# Altium schematic sheet 08_Peripherals.SchDoc
size A4
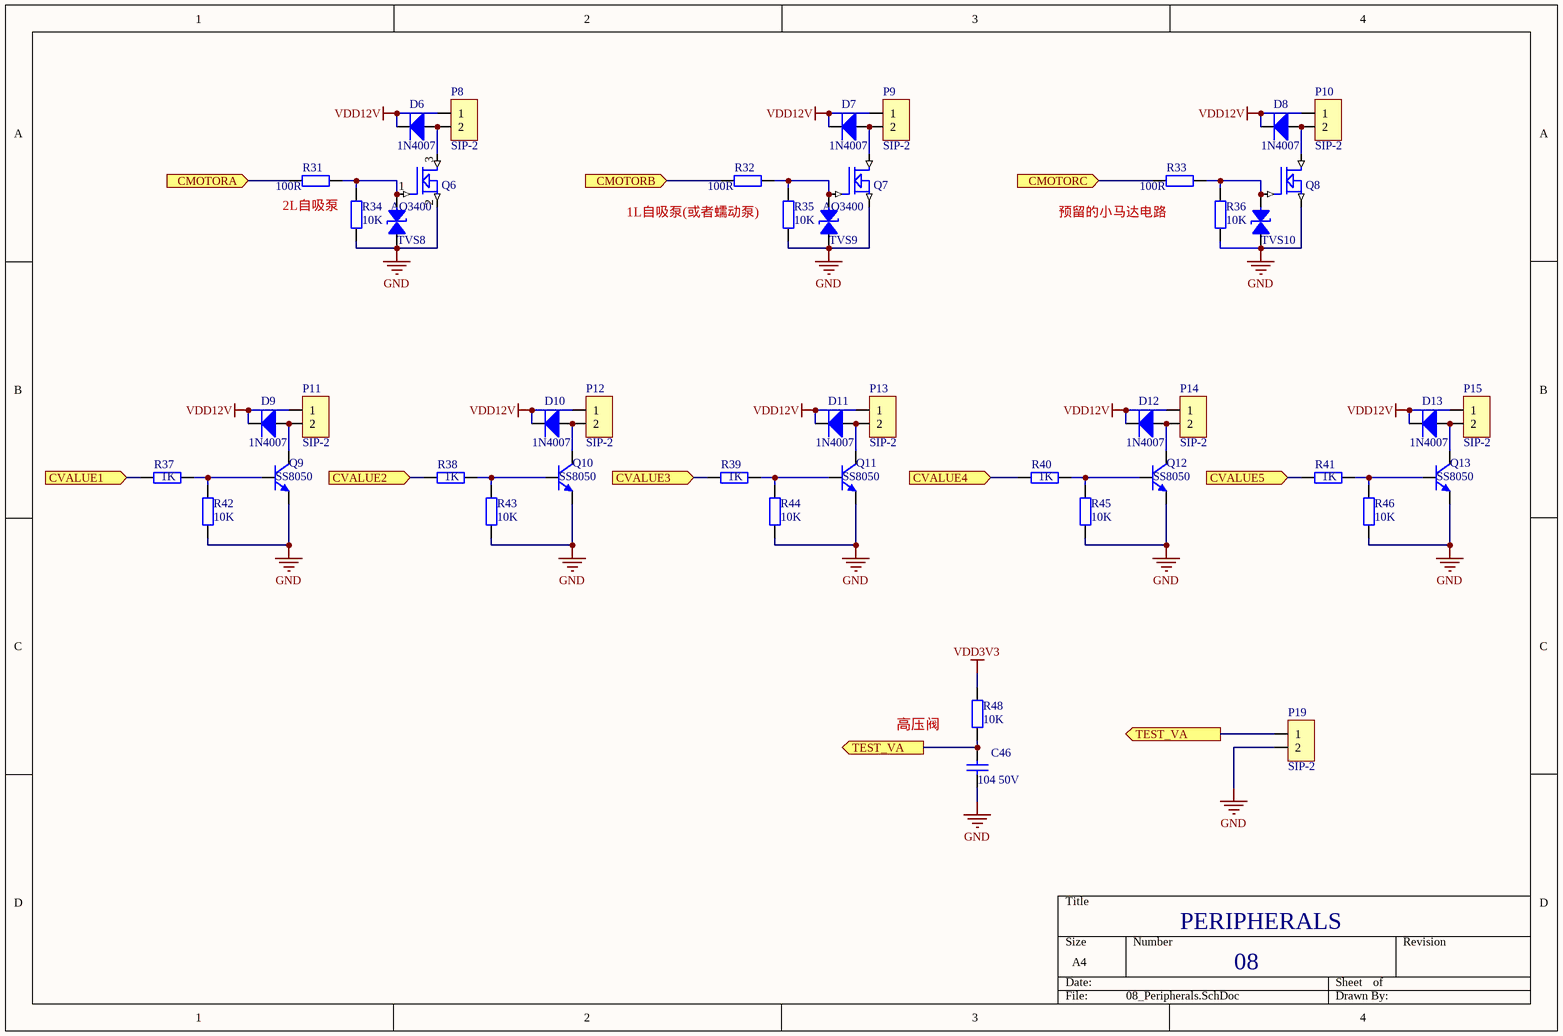
[diagram p0: 08_Peripherals.SchDoc]

## Parts
C46  104 50V  [SMD-0603C]
D6  1N4007  [DO-214-AC]
D7  1N4007  [DO-214-AC]
D8  1N4007  [DO-214-AC]
D9  1N4007  [DO-214-AC]
D10  1N4007  [DO-214-AC]
D11  1N4007  [DO-214-AC]
D12  1N4007  [DO-214-AC]
D13  1N4007  [DO-214-AC]
P8  SIP-2  [XH-2.54-2P-LI]
P9  SIP-2  [XH-2.54-2P-LI]
P10  SIP-2  [XH-2.54-2P-LI]
P11  SIP-2  [XH-2.54-2P-LI]
P12  SIP-2  [XH-2.54-2P-LI]
P13  SIP-2  [XH-2.54-2P-LI]
P14  SIP-2  [XH-2.54-2P-LI]
P15  SIP-2  [XH-2.54-2P-LI]
P19  SIP-2  [XH-2.54-2P-LI]
Q6  AO3400  [SOT-23]
Q7  AO3400  [SOT-23]
Q8  AO3400  [SOT-23]  (value not drawn)
Q9  SS8050  [SOT-23]
Q10  SS8050  [SOT-23]
Q11  SS8050  [SOT-23]
Q12  SS8050  [SOT-23]
Q13  SS8050  [SOT-23]
R31  100R  [SMD-0603]
R32  100R  [SMD-0603]
R33  100R  [SMD-0603]
R34  10K  [SMD-0603]
R35  10K  [SMD-0603]
R36  10K  [SMD-0603]
R37  1K  [SMD-0603]
R38  1K  [SMD-0603]
R39  1K  [SMD-0603]
R40  1K  [SMD-0603]
R41  1K  [SMD-0603]
R42  10K  [SMD-0603]
R43  10K  [SMD-0603]
R44  10K  [SMD-0603]
R45  10K  [SMD-0603]
R46  10K  [SMD-0603]
R48  10K  [SMD-0603]
TVS8  ESD5Z5.0CT1G  [SOD-523]  (value not drawn)
TVS9  ESD5Z5.0CT1G  [SOD-523]  (value not drawn)
TVS10  ESD5Z5.0CT1G  [SOD-523]  (value not drawn)

## Ports
CMOTORA (in), CMOTORB (in), CMOTORC (in), CVALUE1 (in), CVALUE2 (in), CVALUE3 (in), CVALUE4 (in), CVALUE5 (in), TEST_VA (out)

## Nets
GND: C46.1 P19.2 Q6.2(S) Q7.2(S) Q8.2(S) Q9.2(E) Q10.2(E) Q11.2(E) Q12.2(E) Q13.2(E) R34.2 R35.2 R36.2 R42.2 R43.2 R44.2 R45.2 R46.2 TVS8.1(A) TVS9.1(A) TVS10.1(A)
VDD3V3: R48.2
VDD12V: D6.2(K) D7.2(K) D8.2(K) D9.2(K) D10.2(K) D11.2(K) D12.2(K) D13.2(K) P8.1 P9.1 P10.1 P11.1 P12.1 P13.1 P14.1 P15.1
CMOTORA: R31.2 ; port CMOTORA
CMOTORB: R32.2 ; port CMOTORB
CMOTORC: R33.2 ; port CMOTORC
CVALUE1: R37.2 ; port CVALUE1
CVALUE2: R38.2 ; port CVALUE2
CVALUE3: R39.2 ; port CVALUE3
CVALUE4: R40.2 ; port CVALUE4
CVALUE5: R41.2 ; port CVALUE5
TEST_VA: C46.2 P19.1 R48.1 ; port TEST_VA
NetD6_1: D6.1(A) P8.2 Q6.3(D)
NetD7_1: D7.1(A) P9.2 Q7.3(D)
NetD8_1: D8.1(A) P10.2 Q8.3(D)
NetD9_1: D9.1(A) P11.2 Q9.3(C)
NetD10_1: D10.1(A) P12.2 Q10.3(C)
NetD11_1: D11.1(A) P13.2 Q11.3(C)
NetD12_1: D12.1(A) P14.2 Q12.3(C)
NetD13_1: D13.1(A) P15.2 Q13.3(C)
NetQ6_1: Q6.1(G) R31.1 R34.1 TVS8.2(B)
NetQ7_1: Q7.1(G) R32.1 R35.1 TVS9.2(B)
NetQ8_1: Q8.1(G) R33.1 R36.1 TVS10.2(B)
NetQ9_1: Q9.1(B) R37.1 R42.1
NetQ10_1: Q10.1(B) R38.1 R43.1
NetQ11_1: Q11.1(B) R39.1 R44.1
NetQ12_1: Q12.1(B) R40.1 R45.1
NetQ13_1: Q13.1(B) R41.1 R46.1

## Notes on the sheet
- (near R31) 2L自吸泵
- (near R32) 1L自吸泵(或者蠕动泵)
- 预留的小马达电路
- 高压阀
- PERIPHERALS
- 08

## Library data of the parts
C46 = CAP4: 贴片电容 10%
D6-D13 = DIODE2: 贴片二极管
P8-P15 P19 = SIP-2: XH2.54 2P 立贴
Q6-Q8 = MOSFET N
Q9-Q13 = NPN-1: 三极管
R31-R46 R48 = RES-SOP: 贴片电阻 5%
TVS8-TVS10 = TVS-1: TVS